# EAGLE design FunctionGenerator-ICL8038 (EAGLE 7.2.0)
8038 Single supply sine/square/triangle wave generator http://electro-music.com/forum/post-380531.html
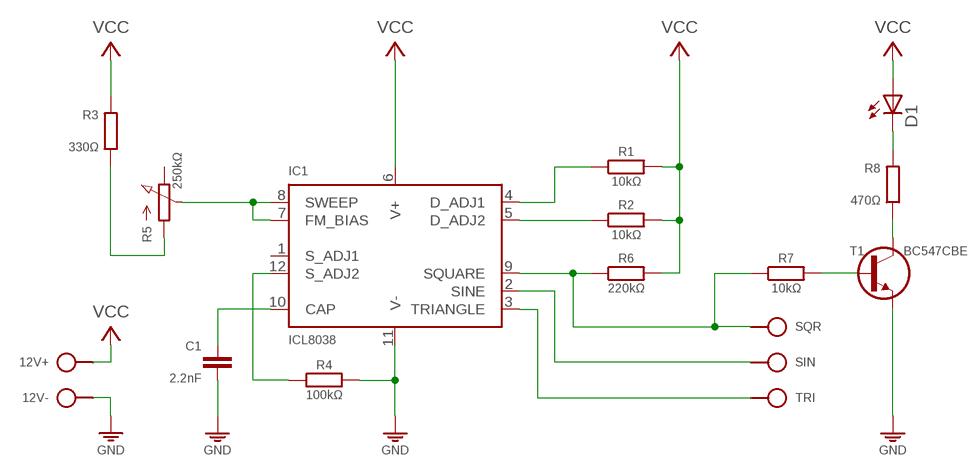
[diagram p0: schematic, sheet 1]

## Parts
12V  SPAD+-  [SPAD-2]
C1  2.2nF  C050-020X044  [C050-020X044]
D1  LED3MM  [LED3MM]
IC1  ICL8038  [DIL14]
R1  10kΩ  R-H0202/5  [0202/5]
R2  10kΩ  R-H0202/5  [0202/5]
R3  330Ω  R0202/5-V  [0202/5-V]
R4  100kΩ  R-H0202/5  [0202/5]
R5  250kΩ  POT  [POT]
R6  220kΩ  R-H0202/5-V  [0202/5-V]
R7  10kΩ  R-H0202/5-V  [0202/5-V]
R8  470Ω  R0202/5-V  [0202/5-V]
SIN  SPAD  [SPAD]
SQR  SPAD  [SPAD]
T1  BC547CBE  [TO92-CBE]
TRI  SPAD  [SPAD]

## Nets
GND: 12V.1 C1.2 IC1.11(V-) R4.2 T1.E
N$2: R3.1 R5.1(A)
N$3: IC1.4(D_ADJ1) R1.1
N$4: IC1.5(D_ADJ2) R2.1
N$5: IC1.9(SQUARE) R6.1 R7.1 SQR.1
N$6: IC1.12(S_ADJ2) R4.1
N$7: C1.1 IC1.10(CAP)
N$8: IC1.3(TRIANGLE) TRI.1
N$9: IC1.2(SINE) SIN.1
N$10: R7.2 T1.B
N$11: D1.K(C) R8.2
N$12: R8.1 T1.C
N$13: IC1.7(FM_BIAS) IC1.8(SWEEP) R5.2(S)
VCC: 12V.2 D1.A IC1.6(V+) R1.2 R2.2 R3.2 R6.2
Unconnected: IC1.1(S_ADJ1) R5.3(E)

## Library data of the parts
12V = pad:SPAD+-
C1 = c:C: CAPACITOR, European symbol
D1 = led:LED: LED OSRAM: - CHIPLED LG R971, LG N971, LY N971, LG Q971, LY Q971, LO R971, LY R971 LH N974, LH R974 LS Q976, LO Q976, LY Q976 LO Q996 - Hyper CHIPLED LW Q18S LB Q993, LB Q99A, LB R99A - SideLED LS A670, LO A670, LY A670, LG A670, LP A670 LB A673, LV A673, LT A673, LW A673 LH A674 LY A675 LS A676, LA A676, LO A676, LY A676, LW A676 LS A679, LY A679, LG A679 - Hyper Micro SIDELED@@ LS Y876, LA Y876, LO Y876, LY Y876 LT Y87S - SmartLED LW L88C, LW L88S LB L89C, LB L89S, LG L890 LS L89K, LO L89K, LY L89K LS L896, LA L896, LO L896, LY L896 - TOPLED LS T670, LO T670, LY T670, LG T670, LP T670 LSG T670, LSP T670, LSY T670, LOP T670, LYG T670 LG T671, LOG T671, LSG T671 LB T673, LV T673, LT T673, LW T673 LH T674 LS T676, LA T676, LO T676, LY T676, LB T676, LH T676, LSB T676, LW T676 LB T67C, LV T67C, LT T67C, LS T67K, LO T67K, LY T67K, LW E67C LS E67B, LA E67B, LO E67B, LY E67B, LB E67C, LV E67C, LT E67C LW T67C LS T679, LY T679, LG T679 LS T770, LO T770, LY T770, LG T770, LP T770 LB T773, LV T773, LT T773, LW T773 LH T774 LS E675, LA E675, LY E675, LS T675 LS T776, LA T776, LO T776, LY T776, LB T776 LHGB T686 LT T68C, LB T68C - Hyper Mini TOPLED@@ LB M676 - Mini TOPLED Santana@@ LG M470 LS M47K, LO M47K, LY M47K Source: http://www.osram.convergy.de LUXEON: - LUMILED@@ LXK2-PW12-R00, LXK2-PW12-S00, LXK2-PW14-U00, LXK2-PW14-V00 LXK2-PM12-R00, LXK2-PM12-S00, LXK2-PM14-U00 LXK2-PE12-Q00, LXK2-PE12-R00, LXK2-PE12-S00, LXK2-PE14-T00, LXK2-PE14-U00 LXK2-PB12-K00, LXK2-PB12-L00, LXK2-PB12-M00, LXK2-PB14-N00, LXK2-PB14-P00, LXK2-PB14-Q00 LXK2-PR12-L00, LXK2-PR12-M00, LXK2-PR14-Q00, LXK2-PR14-R00 LXK2-PD12-Q00, LXK2-PD12-R00, LXK2-PD12-S00 LXK2-PH12-R00, LXK2-PH12-S00 LXK2-PL12-P00, LXK2-PL12-Q00, LXK2-PL12-R00 Source: www.luxeon.com KINGBRIGHT: KA-3528ASYC Source: www.kingbright.com
IC1 = ic:ICL8038
R1 R2 R4 R6 R7 = r:R-H
R3 R8 = r:R: RESISTOR, European symbol
R5 = r:POT
SIN SQR TRI = pad:SPAD
T1 = t:BC547

## Board
8038 Single supply sine/square/triangle wave generator http://electro-music.com/forum/post-380531.html
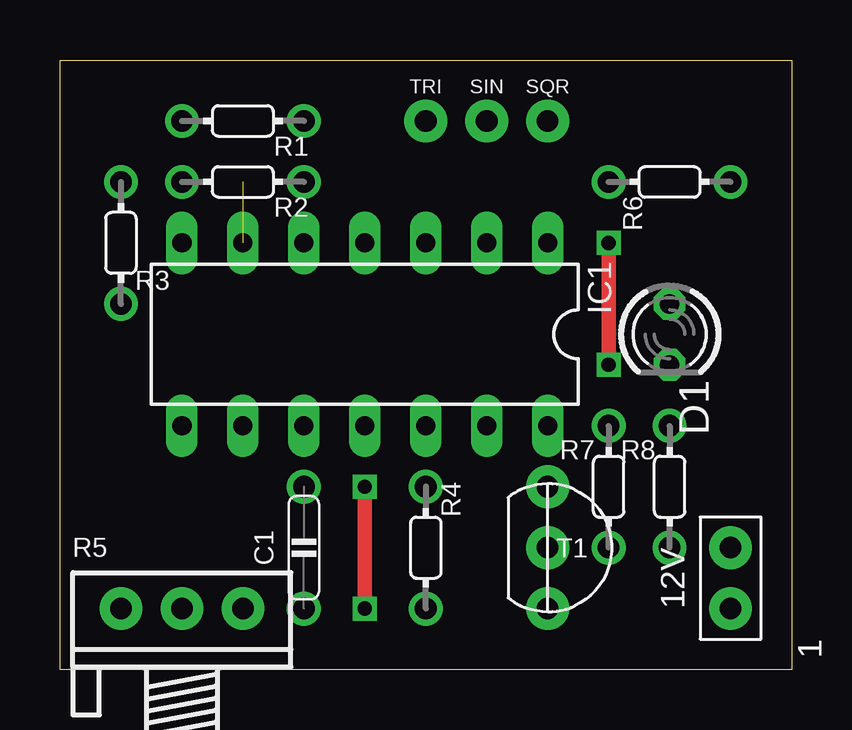
[diagram p1: board, top side]
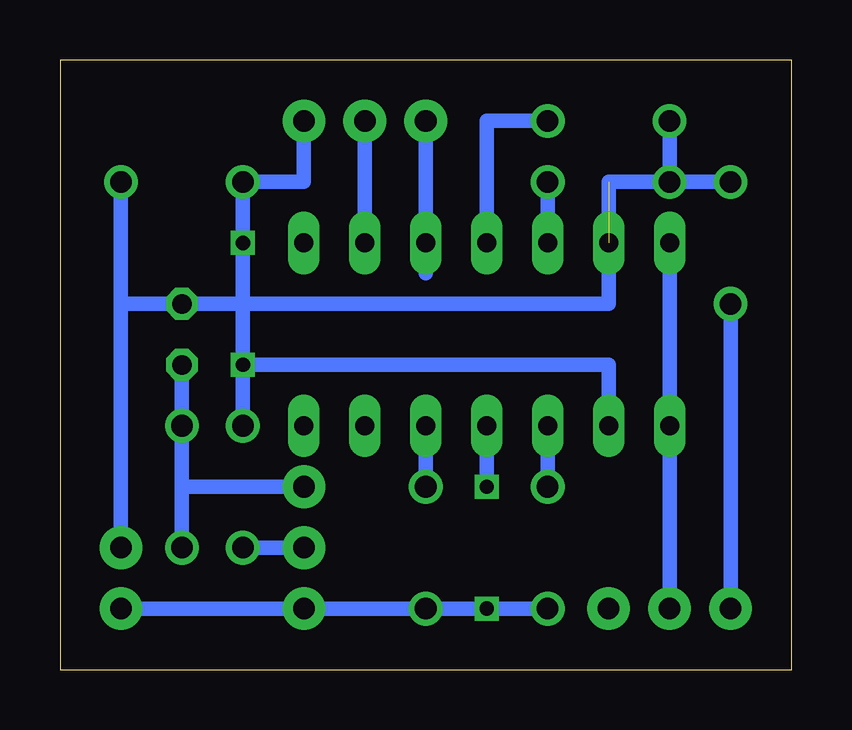
[diagram p2: board, bottom side, seen from below]

Size 30.48 x 25.4 mm. Coordinates in mm from the lower left corner, seen from the top.
Outline: 0,0 0,25.4 30.48,25.4 30.48,0 0,0
Copper layers (1*16): Top 0.035mm / dielectric 1.5mm / Bottom 0.035mm
Design rules "default": minimum track width 10mil, minimum drill 24mil, track to track 8mil, track to pad 8mil, pad to pad 8mil, via to via 8mil, smd to smd 8mil, copper to edge 40mil, drill to drill 8mil, minimum pad ring 10mil, minimum via ring 8mil, stop-mask expansion 4mil, vias tented up to drill 0mil, thermal gap 10mil

### Footprints (pad centres in the part's own frame; a part is rotated, then mirrored left to right if it is on the bottom)
SPAD-2 = drill 0.9 pad 1.778: 1 0,-1.27; 2 0,1.27
C050-020X044 = drill 0.9: 1 2.54,0; 2 -2.54,0
LED3MM = drill 0.813 octagon: A -1.27,0; K 1.27,0
DIL14 = drill 0.8 long: 1 -3.81,7.62; 2 -3.81,5.08; 3 -3.81,2.54; 4 -3.81,0; 5 -3.81,-2.54; 6 -3.81,-5.08; 7 -3.81,-7.62; 8 3.81,-7.62; 9 3.81,-5.08; 10 3.81,-2.54; 11 3.81,0; 12 3.81,2.54; 13 3.81,5.08; 14 3.81,7.62
0202/5 = drill 0.9: 1 -2.54,0; 2 2.54,0
0202/5-V = drill 0.9: 1 0,2.54; 2 0,-2.54
POT = drill 0.9 pad 1.778: 1 -2.54,0; 2 0,0; 3 2.54,0
SPAD = drill 0.9 pad 1.778: 1 0,0
TO92-CBE = drill 0.9 pad 1.778: B 0,0; C 0,2.54; E 0,-2.54

### Placement (x,y rotation side)
12V  27.94,3.81 0 top
C1  10.16,5.08 90 top
D1  25.4,13.97 270 top
IC1  12.7,13.97 270 top
R1  7.62,22.86 180 top
R2  7.62,20.32 180 top
R3  2.54,17.78 180 top
R4  15.24,5.08 270 top
R5  5.08,2.54 0 top
R6  25.4,20.32 90 top
R7  22.86,7.62 0 top
R8  25.4,7.62 0 top
SIN  17.78,22.86 270 top
SQR  20.32,22.86 270 top
T1  20.32,5.08 0 top
TRI  15.24,22.86 270 top

### Tracks (layer width: path | path; a pad name or v marks a point on that pad's centre or on a via)
GND  (via drill 0.6)
  Top 0.61: v12.7,2.54 v12.7,7.62
  Bottom 0.61: v12.7,7.62 IC1.11 | v12.7,2.54 R4.2 | 12V.1 T1.E v12.7,2.54 | v12.7,2.54 C1.2
N$2
  Bottom 0.61: R3.1 R5.1
N$3
  Bottom 0.61: R1.1 12.7,22.86 IC1.4
N$4
  Bottom 0.61: IC1.5 R2.1
N$5  (via drill 0.6)
  Top 0.61: v22.86,12.7 v22.86,17.78
  Bottom 0.61: IC1.9 7.62,12.7 v22.86,12.7 | SQR.1 20.32,20.32 R6.1 v22.86,17.78 v22.86,12.7 | R7.1 v22.86,12.7
N$6
  Bottom 0.61: IC1.12 R4.1
N$7
  Bottom 0.61: IC1.10 C1.1
N$8
  Bottom 0.61: TRI.1 IC1.3 15.24,16.51
N$9
  Bottom 0.61: IC1.2 SIN.1
N$10
  Bottom 0.61: T1.B R7.2
N$11
  Bottom 0.61: R8.2 D1.K
N$12
  Bottom 0.61: T1.C 25.4,7.62 R8.1
N$13
  Bottom 0.61: R5.2 IC1.8 IC1.7
VCC  (1 unrouted)
  Bottom 0.61: R2.2 7.62,20.32 7.62,15.24 D1.A 27.94,15.24 | 27.94,15.24 R6.2 | R3.2 R2.2 | R1.2 R2.2 | 12V.2 27.94,15.24